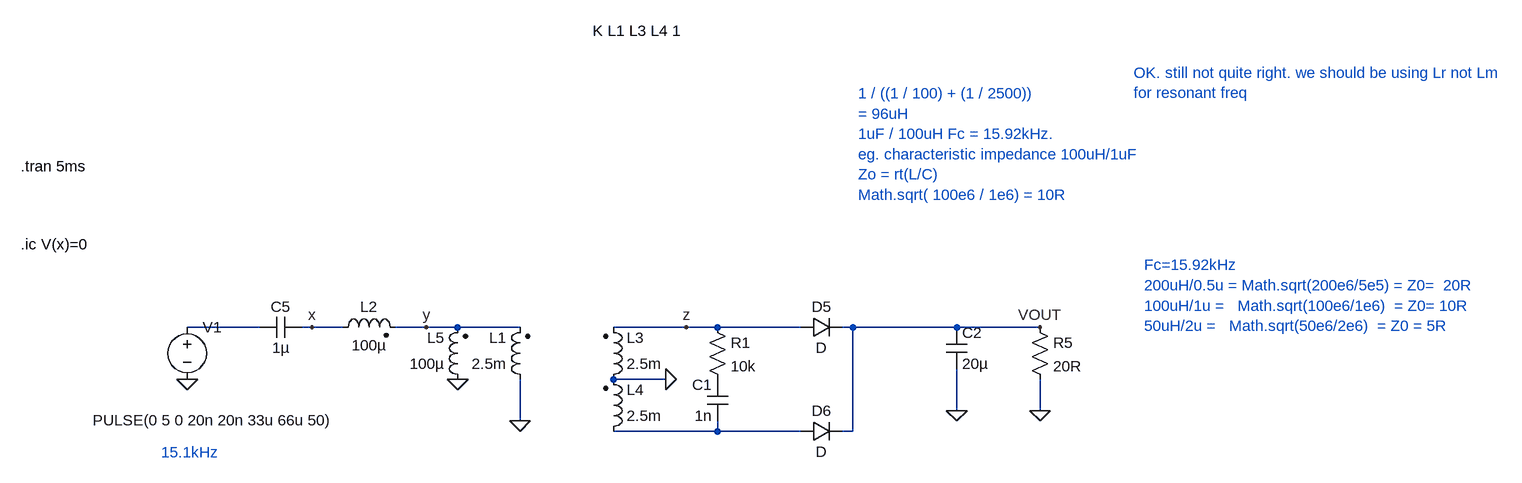
[diagram p0: schematic Draft203.asc]
Draft203.asc, the LTspice schematic file:
Version 4
SHEET 1 5720 1740
WIRE 512 0 400 0
WIRE 592 0 576 0
WIRE 640 0 592 0
WIRE 768 0 720 0
WIRE 816 0 768 0
WIRE 912 0 816 0
WIRE 1168 0 1056 0
WIRE 1216 0 1168 0
WIRE 1344 0 1216 0
WIRE 1424 0 1408 0
WIRE 1584 0 1424 0
WIRE 1712 0 1584 0
WIRE 1136 80 1056 80
WIRE 1584 128 1584 64
WIRE 1712 128 1712 80
WIRE 912 144 912 80
WIRE 1216 160 1216 144
WIRE 1216 160 1056 160
WIRE 1344 160 1216 160
WIRE 1424 160 1424 0
WIRE 1424 160 1408 160
FLAG 1712 128 0
FLAG 1136 80 0
FLAG 912 144 0
FLAG 1712 0 VOUT
FLAG 400 80 0
FLAG 1584 128 0
FLAG 592 0 x
FLAG 768 0 y
FLAG 1168 0 z
FLAG 816 80 0
SYMBOL ind2 928 96 R180
WINDOW 0 36 80 Left 2
WINDOW 3 36 40 Left 2
SYMATTR InstName L1
SYMATTR Value 2.5m
SYMATTR Type ind
SYMBOL ind2 1040 96 M180
WINDOW 0 36 80 Left 2
WINDOW 3 36 40 Left 2
SYMATTR InstName L3
SYMATTR Value 2.5m
SYMATTR Type ind
SYMBOL diode 1344 16 R270
WINDOW 0 32 32 VTop 2
WINDOW 3 0 32 VBottom 2
SYMATTR InstName D5
SYMBOL diode 1344 176 R270
WINDOW 0 32 32 VTop 2
WINDOW 3 0 32 VBottom 2
SYMATTR InstName D6
SYMBOL cap 1568 0 R0
SYMATTR InstName C2
SYMATTR Value 20µ
SYMBOL res 1696 -16 R0
SYMATTR InstName R5
SYMATTR Value 20R
SYMBOL ind2 1040 176 M180
WINDOW 0 36 80 Left 2
WINDOW 3 36 40 Left 2
SYMATTR InstName L4
SYMATTR Value 2.5m
SYMATTR Type ind
SYMBOL cap 576 -16 R90
WINDOW 0 0 32 VBottom 2
WINDOW 3 32 32 VTop 2
SYMATTR InstName C5
SYMATTR Value 1µ
SYMBOL ind2 624 16 R270
WINDOW 0 32 56 VTop 2
WINDOW 3 4 56 VBottom 2
SYMATTR InstName L2
SYMATTR Value 100µ
SYMATTR Type ind
SYMBOL voltage 400 -16 R0
WINDOW 123 0 0 Left 0
WINDOW 39 0 0 Left 0
WINDOW 3 -145 159 Left 2
SYMATTR Value PULSE(0 5 0 20n 20n 33u 66u 50)
SYMATTR InstName V1
SYMBOL cap 1232 144 R180
WINDOW 0 24 56 Left 2
WINDOW 3 24 8 Left 2
SYMATTR InstName C1
SYMATTR Value 1n
SYMBOL res 1200 -16 R0
SYMATTR InstName R1
SYMATTR Value 10k
SYMBOL ind2 832 96 R180
WINDOW 0 36 80 Left 2
WINDOW 3 36 40 Left 2
SYMATTR InstName L5
SYMATTR Value 100µ
SYMATTR Type ind
TEXT 144 -248 Left 2 !.tran 5ms
TEXT 1024 -456 Left 2 !K L1 L3 L4 1
TEXT 144 -128 Left 2 !.ic V(x)=0
TEXT 1432 -360 Left 2 ;1 / ((1 / 100) + (1 / 2500))\n= 96uH\n1uF / 100uH Fc = 15.92kHz.\neg. characteristic impedance 100uH/1uF\nZo = rt(L/C)\nMath.sqrt( 100e6 / 1e6) = 10R
TEXT 360 192 Left 2 ;15.1kHz
TEXT 1872 -96 Left 2 ;Fc=15.92kHz\n200uH/0.5u = Math.sqrt(200e6/5e5) = Z0=  20R\n100uH/1u =   Math.sqrt(100e6/1e6)  = Z0= 10R\n50uH/2u =   Math.sqrt(50e6/2e6)  = Z0 = 5R
TEXT 1856 -392 Left 2 ;OK. still not quite right. we should be using Lr not Lm\nfor resonant freq

The netlist it stands for:
* Draft203.asc
L1 0 y 2.5m
L3 0 z 2.5m
D5 z VOUT D
D6 N002 VOUT D
C2 VOUT 0 20µ
R5 VOUT 0 20R
L4 N002 0 2.5m
C5 x N001 1µ
L2 x y 100µ
V1 N001 0 PULSE(0 5 0 20n 20n 33u 66u 50)
C1 N002 P001 1n
R1 z P001 10k
L5 0 y 100µ
.model D D
.lib standard.dio
.tran 5ms
K L1 L3 L4 1
.ic V(x)=0
* 1 / ((1 / 100) + (1 / 2500))
* = 96uH
* 1uF / 100uH Fc = 15.92kHz.
* eg. characteristic impedance 100uH/1uF
* Zo = rt(L/C)
* Math.sqrt( 100e6 / 1e6) = 10R
* 15.1kHz
* Fc=15.92kHz
* 200uH/0.5u = Math.sqrt(200e6/5e5) = Z0=  20R
* 100uH/1u =   Math.sqrt(100e6/1e6)  = Z0= 10R
* 50uH/2u =   Math.sqrt(50e6/2e6)  = Z0 = 5R
* OK. still not quite right. we should be using Lr not Lm
* for resonant freq
.backanno
.end